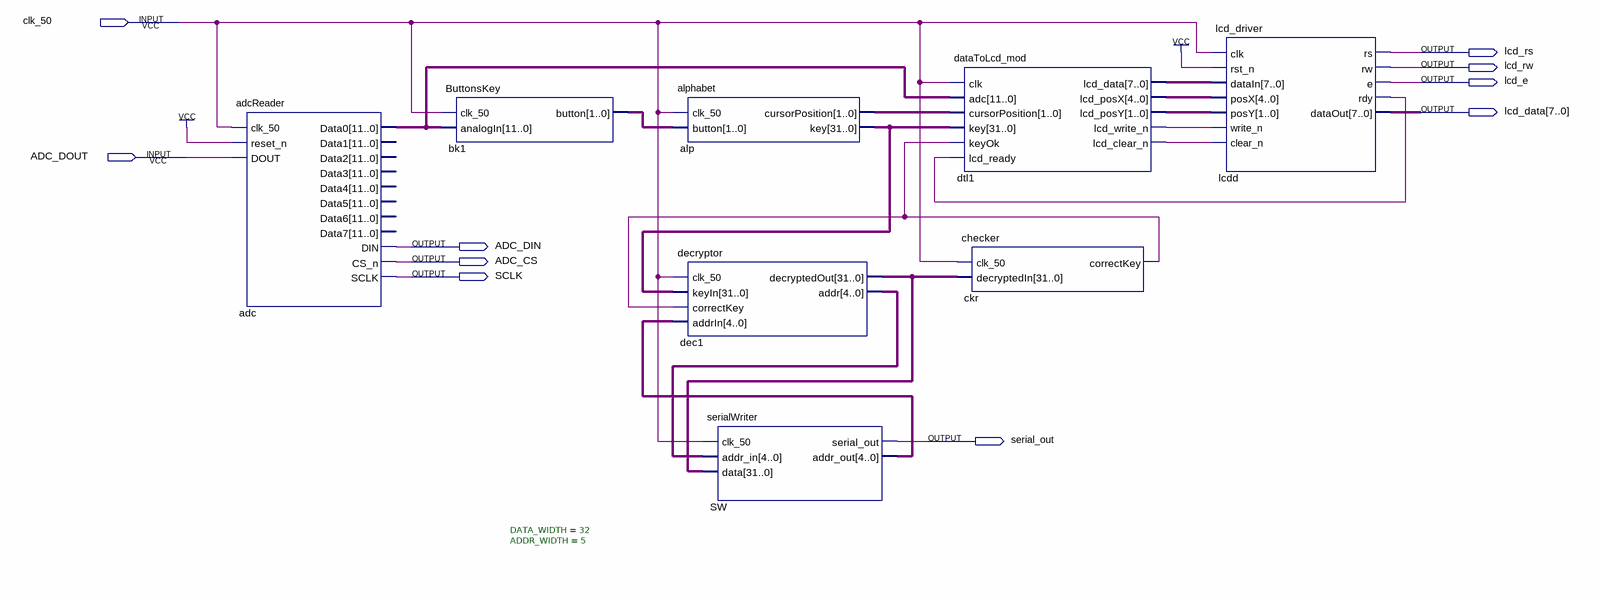
[diagram p0: schematic sheet]
// Quartus schematic Competition.bdf as structural Verilog: 8 symbols, 10 pins
module Competition (
  input  clk_50,
  input  ADC_DOUT,
  output lcd_rs,
  output lcd_rw,
  output lcd_e,
  output [7:0] lcd_data,
  output ADC_DIN,
  output ADC_CS,
  output SCLK,
  output serial_out
);

  wire ckr_correctkey, dtl1_lcd_clear_n, dtl1_lcd_write_n, lcdd_rdy;
  wire [1:0] alp_cursorposition, bk1_button, dtl1_lcd_posy;
  wire [4:0] dec1_addr, dtl1_lcd_posx, SW_addr_out;
  wire [7:0] dtl1_lcd_data;
  wire [11:0] adc_data0;
  wire [31:0] alp_key, dec1_decryptedout;

  adcReader adc (
    .clk_50(clk_50), .reset_n(1'b1), .DOUT(ADC_DOUT), .Data0(adc_data0), .DIN(ADC_DIN), .CS_n(ADC_CS),
    .SCLK(SCLK));  // open: Data1, Data2, Data3, Data4, Data5, Data6, Data7
  ButtonsKey bk1 (.clk_50(clk_50), .analogIn(adc_data0), .button(bk1_button));
  alphabet alp (.clk_50(clk_50), .button(bk1_button), .cursorPosition(alp_cursorposition), .key(alp_key));
  decryptor dec1 (
    .clk_50(clk_50), .keyIn(alp_key), .correctKey(ckr_correctkey), .addrIn(SW_addr_out),
    .decryptedOut(dec1_decryptedout), .addr(dec1_addr));
  serialWriter #(.DATA_WIDTH(32), .ADDR_WIDTH(5)) SW (
    .clk_50(clk_50), .addr_in(dec1_addr), .data(dec1_decryptedout), .serial_out(serial_out),
    .addr_out(SW_addr_out));
  dataToLcd_mod dtl1 (
    .clk(clk_50), .adc(adc_data0), .cursorPosition(alp_cursorposition), .key(alp_key),
    .keyOk(ckr_correctkey), .lcd_ready(lcdd_rdy), .lcd_data(dtl1_lcd_data), .lcd_posX(dtl1_lcd_posx),
    .lcd_posY(dtl1_lcd_posy), .lcd_write_n(dtl1_lcd_write_n), .lcd_clear_n(dtl1_lcd_clear_n));
  \checker  ckr (.clk_50(clk_50), .decryptedIn(dec1_decryptedout), .correctKey(ckr_correctkey));
  lcd_driver lcdd (
    .clk(clk_50), .rst_n(1'b1), .dataIn(dtl1_lcd_data), .posX(dtl1_lcd_posx), .posY(dtl1_lcd_posy),
    .write_n(dtl1_lcd_write_n), .clear_n(dtl1_lcd_clear_n), .rs(lcd_rs), .rw(lcd_rw), .e(lcd_e),
    .rdy(lcdd_rdy), .dataOut(lcd_data));
endmodule
